# Altium schematic sheet plp-cd_3a.SchDoc
size 594 x 420 mm; PageSetup: Record=PageOptions|CenterHorizontal=False|CenterVertical=False|PrintScale=2.14|XCorrection=0.00|YCorrection=0.00|PrintKind=2|BorderSize=5000000|LeftOffset=0|BottomOffset=0|Orientation=2|PaperLength=4200|PaperWidth=2970|Scale=100|PaperSource=7|PrintQuality=600|MediaType=1|DitherType=10|PrintScaleMode=1|PaperKind=A3; Rule: PcbType=ProtelPcb; Rule: PcbType=ProtelPcb; Rule: PcbType=ProtelPcb; Rule: PcbType=ProtelPcb; Rule: PcbType=ProtelPcb; Rule: PcbType=ProtelPcb; Rule: PcbType=ProtelPcb; Rule: PcbType=ProtelPcb; Rule: PcbType=ProtelPcb; Rule: PcbType=ProtelPcb; Rule: PcbType=ProtelPcb; Rule: PcbType=ProtelPcb
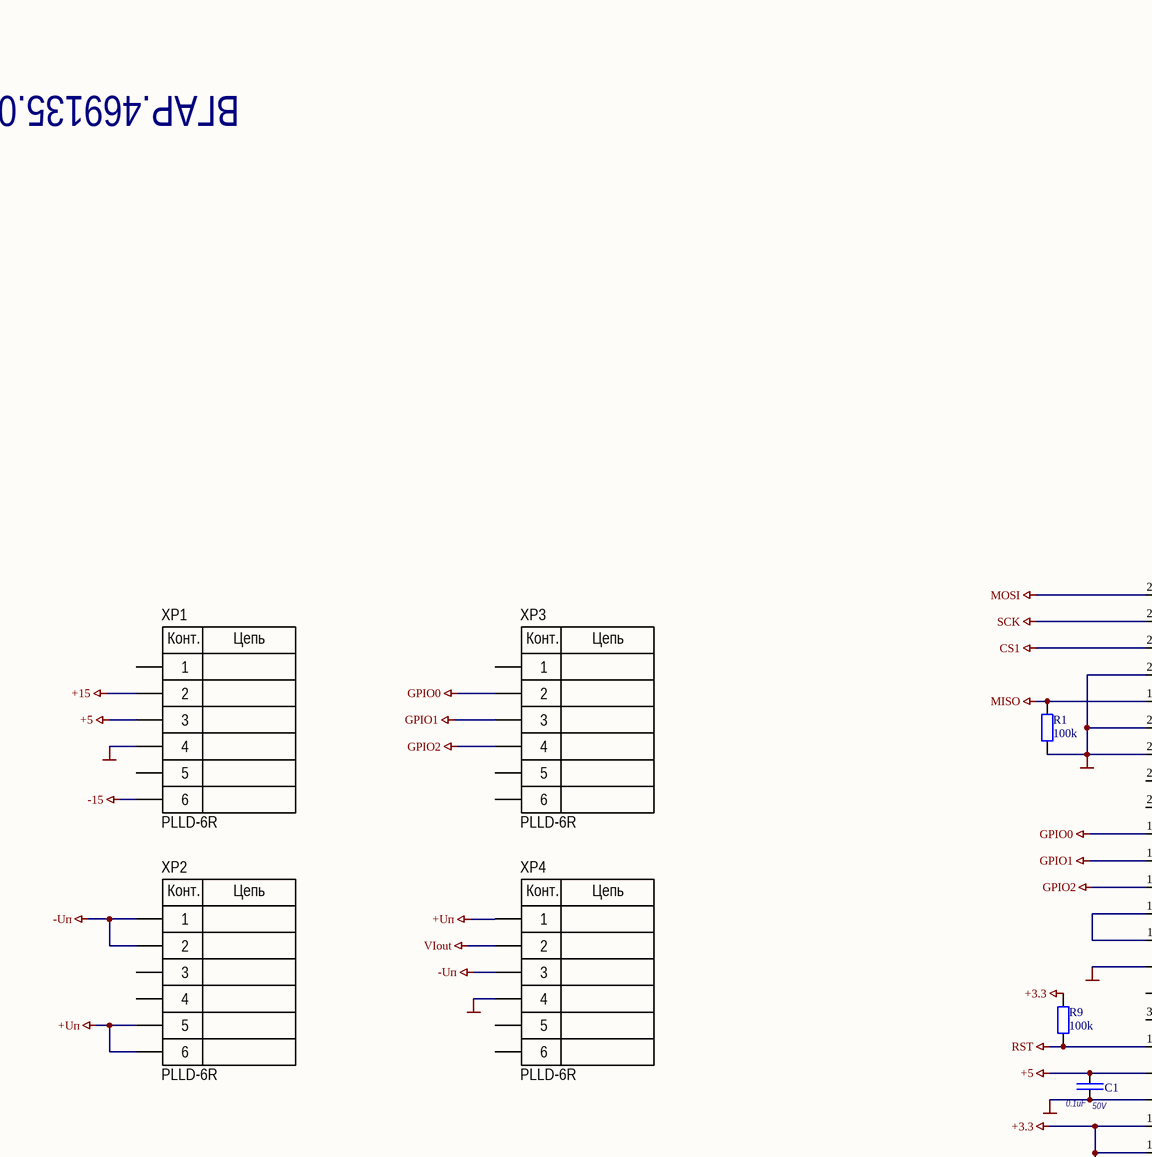
[diagram p0: plp-cd_3a.SchDoc, top left]
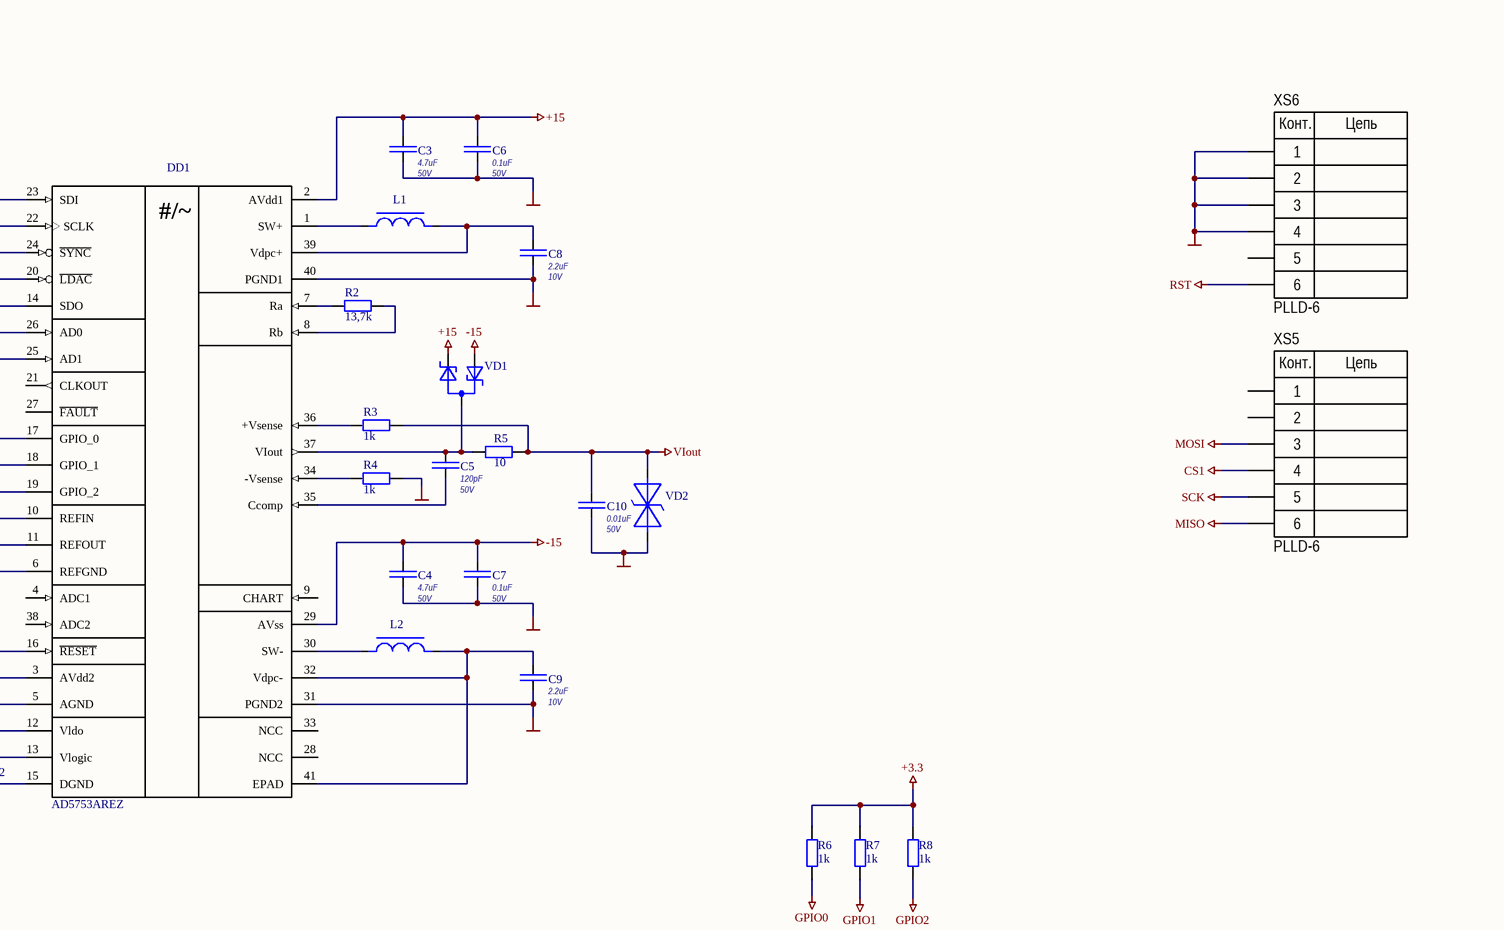
[diagram p1: plp-cd_3a.SchDoc, top right]
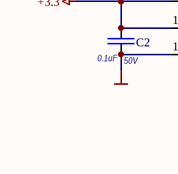
[diagram p2: plp-cd_3a.SchDoc, bottom left]
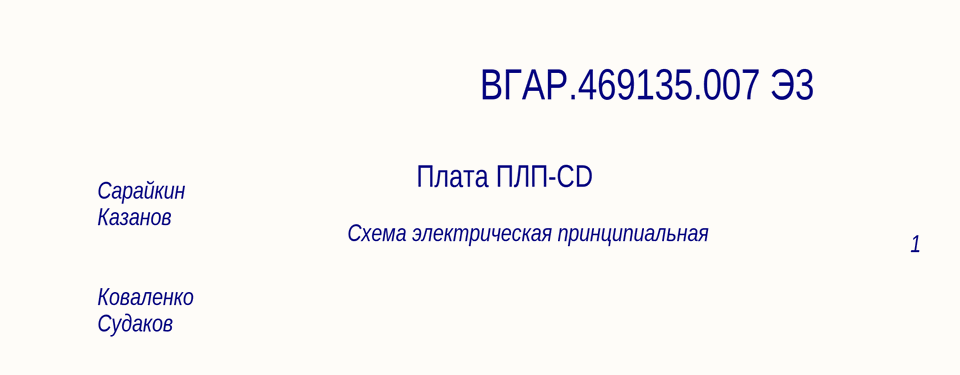
[diagram p3: plp-cd_3a.SchDoc, bottom right]

## Parts
C1  value 0.1uF  Rated DC Voltage: 50V  [CAPC_0603(1608)X080L]  (hidden comment: Capacitor Ceramic)
C2  value 0.1uF  Rated DC Voltage: 50V  [CAPC_0603(1608)X080L]  (hidden comment: Capacitor Ceramic)
C3  value 4.7uF  Rated DC Voltage: 50V  [CAPC_0603(1608)X080L]  (hidden comment: Capacitor Ceramic)
C4  value 4.7uF  Rated DC Voltage: 50V  [CAPC_0603(1608)X080L]  (hidden comment: Capacitor Ceramic)
C5  value 120pF  Rated DC Voltage: 50V  [CAPC_0603(1608)X080L]  (hidden comment: Capacitor Ceramic)
C6  value 0.1uF  Rated DC Voltage: 50V  [CAPC_0603(1608)X080L]  (hidden comment: Capacitor Ceramic)
C7  value 0.1uF  Rated DC Voltage: 50V  [CAPC_0603(1608)X080L]  (hidden comment: Capacitor Ceramic)
C8  value 2.2uF  Rated DC Voltage: 10V  [CAPC_0603(1608)X080L]  (hidden comment: Capacitor Ceramic)
C9  value 2.2uF  Rated DC Voltage: 10V  [CAPC_0603(1608)X080L]  (hidden comment: Capacitor Ceramic)
C10  value 0.01uF  Rated DC Voltage: 50V  [CAPC_0603(1608)X080L]  (hidden comment: Capacitor Ceramic)
DD1  AD5753AREZ  [CP-40-15]
L1  CDRH4D28  [CDRH4D28_INDP5050X28N]  (value not drawn)
L2  CDRH4D28  [CDRH4D28_INDP5050X28N]  (value not drawn)
R1  value 100k  [RESC1608(0603)X04L]  (hidden comment: R0603L)
R2  value 13,7k  [RESC1608(0603)X04L]  (hidden comment: R0603L)
R3  value 1k  [RESC1608(0603)X04L]  (hidden comment: R0603L)
R4  value 1k  [RESC1608(0603)X04L]  (hidden comment: R0603L)
R5  value 10  [RESC1608(0603)X04L]  (hidden comment: R0603L)
R6  value 1k  [RESC1608(0603)X04L]  (hidden comment: R0603L)
R7  value 1k  [RESC1608(0603)X04L]  (hidden comment: R0603L)
R8  value 1k  [RESC1608(0603)X04L]  (hidden comment: R0603L)
R9  value 100k  [RESC1608(0603)X04L]  (hidden comment: R0603L)
VD1  BAT54SW  [SC-70]  (value not drawn)
VD2  Transil Bi  [SMB - UNI]  (value not drawn)
XP1  PLLD-6R  [CON: PLL-6(2x3R1.27male)]
XP2  PLLD-6R  [CON: PLL-6(2x3R1.27male)]
XP3  PLLD-6R  [CON: PLL-6(2x3R1.27male)]
XP4  PLLD-6R  [CON: PLL-6(2x3R1.27male)]
XS5  PLLD-6  [CON: PLL-6(2x3R1.27female)]
XS6  PLLD-6  [CON: PLL-6(2x3R1.27female)]

## Nets
+3.3: C2.2 DD1.12(Vldo) DD1.13(Vlogic) R6.2 R7.2 R8.2 R9.1
+5: C1.2 DD1.3(AVdd2) XP1.3
+15: C3.2 C6.2 DD1.2(AVdd1) VD1.2(C) XP1.2
+Uп: XP2.5 XP2.6 XP4.1
-15: C4.2 C7.2 DD1.29(AVss) VD1.1(A) XP1.6
-Uп: XP2.1 XP2.2 XP4.3
CS1: DD1.24(~{SYNC}) XS5.4
GND: C1.1 C2.1 C3.1 C4.1 C6.1 C7.1 C8.1 C9.1 C10.1 DD1.5(AGND) DD1.6(REFGND) DD1.15(DGND) DD1.20(~{LDAC}) DD1.25(AD1) DD1.26(AD0) DD1.31(PGND2) DD1.40(PGND1) R1.2 R4.2 VD2.1(C) XP1.4 XP4.4 XS6.1 XS6.2 XS6.3 XS6.4
GPIO0: DD1.17(GPIO_0) R6.1 XP3.2
GPIO1: DD1.18(GPIO_1) R7.1 XP3.3
GPIO2: DD1.19(GPIO_2) R8.1 XP3.4
MISO: DD1.14(SDO) R1.1 XS5.6
MOSI: DD1.23(SDI) XS5.3
RST: DD1.16(~{RESET}) R9.2 XS6.6
SCK: DD1.22(SCLK) XS5.5
VIout: C10.2 R3.2 R5.2 VD2.2(A) XP4.2
NetC5_1: C5.1 DD1.35(Ccomp)
NetC5_2: C5.2 DD1.37(VIout) R5.1 VD1.3(OAC)
NetC8_2: C8.2 DD1.39(Vdpc+) L1.2
NetC9_2: C9.2 DD1.32(Vdpc-) DD1.41(EPAD) L2.2
NetDD1_1: DD1.1(SW+) L1.1
NetDD1_7: DD1.7(Ra) R2.1
NetDD1_8: DD1.8(Rb) R2.2
NetDD1_10: DD1.10(REFIN) DD1.11(REFOUT)
NetDD1_30: DD1.30(SW-) L2.1
NetDD1_34: DD1.34(-Vsense) R4.1
NetDD1_36: DD1.36(+Vsense) R3.1

Not connected (* = marked no-connect by the designer): DD1 4(ADC1) 9(CHART) 21(CLKOUT) 27(~{FAULT}) 28(NCC) 33(NCC) 38(ADC2); XP1 1 5; XP2 3 4; XP3 1 5 6; XP4 5 6; XS5 1 2; XS6 5

## Notes on the sheet
- ВГАР.469135.007 Э3
- Плата ПЛП-CD
- Сарайкин
- Казанов
- Схема электрическая принципиальная
- 1
- Коваленко
- Судаков
- Перв. примен.
- Справ. №
- Подп. и дата
- Инв. № дубл.
- Взам. инв. №
- Изм.
- Лист
- № докум.
- Подп.
- Дата
- Лит.
- Масса
- Масштаб
- Т.контр.
- Пров.
- Разраб.
- Листов
- Инв. № подл.
- Н.контр.
- Утв.
- Копировал
- Формат А2
- (in symbol AD5753) #/~
- (in symbol PLLD-6(Female)) Конт.; Цепь
- (in symbol PLLD-6R(Male)) Конт.; Цепь

## Library data of the parts
C1-C10 = Capacitor Ceramic: Конденсатор; Manufacturer: Murata; ReplacementPart1Manufacturer: TDK; ReplacementPart2Manufacturer: Taiyo Yuden; ESR: * mOhm; OrderCode: 0603 - 4,7мкФ ±10% - 10В - X5R; TC Code: X5R; Tolerance: ±10%; Case: 0603; ComponentLink1Description: Global Data; ComponentLink1URL: http://www.murata.com/products/capacitor/tech_data/index.html; ComponentLink2Description: Part Data Sheet; ComponentLink2URL: *; ComponentLink3Description: Replacement Data Sheet; ComponentLink3URL: *; ComponentLink4Description: Replacement 2 Data Sheet; ComponentLink4URL: *; PartNumber: *; ReplacementPart1PartNumber: *; ReplacementPart2PartNumber: *; Ripple Current Rating: *; Temperature Range: -55 to +125°C
DD1 = AD5753: Микросхема; Manufacturer: Analog Devices; PartNumber: AD5753AREZ
R1-R9 = R0603L: Резистор; Manufacturer: Bourns; Max Rated DC Voltage: 100 В; Power: 1/10 Вт; Rated DC Voltage: 50 В; Rated T: -55 °C to +125 °C; Resistance Code: 0603 {Value} Ом ±1 %; TKR: ±100 ppm; Tolerance: ±1 %; ComponentLink1Description: Data Sheet; ComponentLink1URL: http://smd.ru/files/upload/1207/ru/chip-resis.pdf; Case: 0603; ComponentLink2Description: Specific Res Only; ComponentLink2URL: *; ComponentLink3Description: Replacement Data Sheet; ComponentLink3URL: *; ComponentLink4Description: Replacement 2 Data Sheet; ComponentLink4URL: *; OrderCode: *; PartNumber: *; ReplacementPart1Manufacturer: *; ReplacementPart1PartNumber: *; ReplacementPart2Manufacturer: *; ReplacementPart2PartNumber: *; Temperature Range: -55 to +125°C
VD1 = BAT54SW: Сборка диодная; Manufacturer: NXP; ReplacementPart1Manufacturer: ON Semiconductor; ReplacementPart1PartNumber: BAT54SWT1G; ReplacementPart1TopMarking: B8*; ReplacementPart2Manufacturer: Infineon; ReplacementPart2TopMarking: TS; ReplacementPart2PartNumber: BAT54-04W; TopMarking: 44; Package: SC-70; PartNumber: BAT54SW; ComponentLink1Description: DataSheet; ComponentLink1URL: http://www.nxp.com/documents/data_sheet/BAT54W.pdf; Power/Voltage: *; Type: *; ComponentLink2URL: http://www.onsemi.com/pub_link/Collateral/BAT54SWT1-D.PDF; ComponentLink3Description: Replacement2DataSheet; ComponentLink3URL: http://www.infineon.com/dgdl/bat54series.pdf?folderId=db3a30431400ef68011425f1ca2505e3&fileId=db3a304314dca3890115190b74210ea6; ComponentLink2Description: Replacement1DataSheet
VD2 = Transil Bi: TVS Диод; Manufacturer: ST Microelectronics; ComponentLink1Descriprion: Data Sheet; ComponentLink1URL: *; ComponentLink2Description: Replacement 1 Data Sheet; ComponentLink2URL: *; ComponentLink3Description: Replacement 2 Data Sheet; ComponentLink3URL: *; PartNumber: *; ReplacementPart1Manufacturer: *; ReplacementPart1PartNumber: *; ReplacementPart1TopMarking: *; ReplacementPart2Manufacturer: *; ReplacementPart2TopMarking: *; TopMarking: *; ReplacementPart2PartNumber: *; StandOffVoltage: *
XP1-XP4 = PLLD-6R(Male): Step 1.27 R
XS5 XS6 = PLLD-6(Female): Step 1.27
L1 L2 = CDRH4D28: Part Number GOST: *